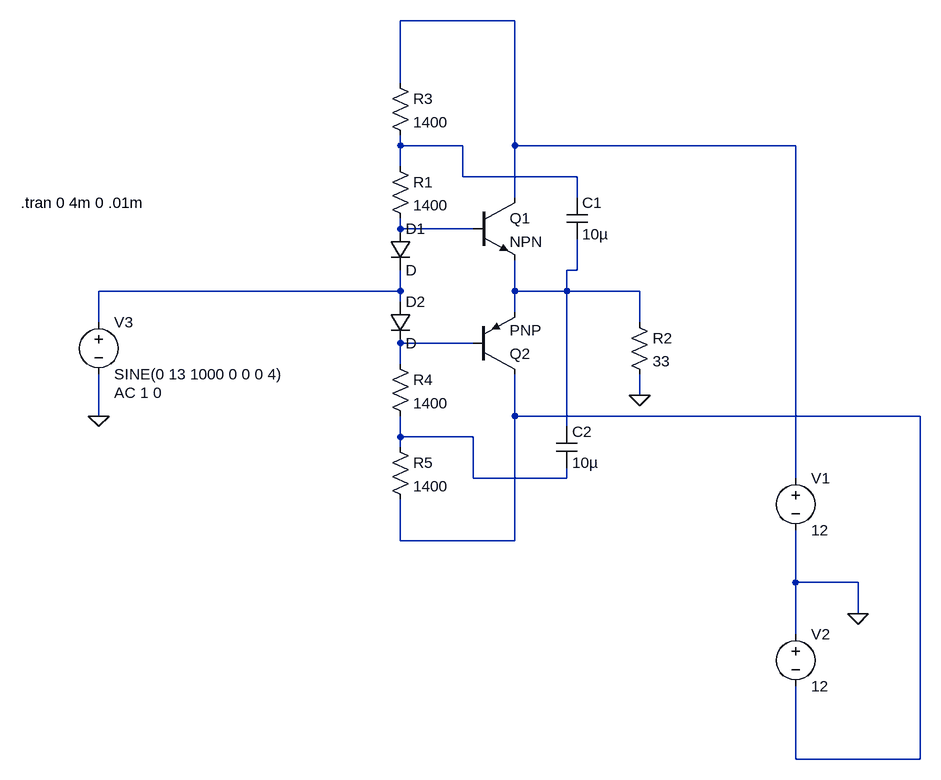
[diagram p0: schematic claseab3.asc]
claseab3.asc, the LTspice schematic file:
Version 4
SHEET 1 884 680
WIRE 256 -704 80 -704
WIRE 80 -608 80 -704
WIRE 80 -512 80 -528
WIRE 176 -512 80 -512
WIRE 256 -512 256 -704
WIRE 688 -512 256 -512
WIRE 80 -480 80 -512
WIRE 176 -464 176 -512
WIRE 352 -464 176 -464
WIRE 256 -432 256 -512
WIRE 352 -432 352 -464
WIRE 80 -384 80 -400
WIRE 192 -384 80 -384
WIRE 352 -320 352 -368
WIRE 352 -320 336 -320
WIRE 80 -288 80 -320
WIRE 80 -288 -384 -288
WIRE 256 -288 256 -336
WIRE 336 -288 336 -320
WIRE 336 -288 256 -288
WIRE 448 -288 336 -288
WIRE 80 -272 80 -288
WIRE 256 -256 256 -288
WIRE -384 -240 -384 -288
WIRE 448 -240 448 -288
WIRE 192 -208 80 -208
WIRE 80 -176 80 -208
WIRE 448 -128 448 -160
WIRE -384 -96 -384 -160
WIRE 256 -96 256 -160
WIRE 880 -96 256 -96
WIRE 336 -80 336 -288
WIRE 80 -64 80 -96
WIRE 192 -64 80 -64
WIRE 80 -48 80 -64
WIRE 192 0 192 -64
WIRE 336 0 336 -16
WIRE 336 0 192 0
WIRE 688 0 688 -512
WIRE 80 96 80 32
WIRE 256 96 256 -96
WIRE 256 96 80 96
WIRE 688 160 688 80
WIRE 784 160 688 160
WIRE 784 208 784 160
WIRE 688 240 688 160
WIRE 688 432 688 320
WIRE 880 432 880 -96
WIRE 880 432 688 432
FLAG 784 208 0
FLAG -384 -96 0
FLAG 448 -128 0
DATAFLAG 416 -288 ""
DATAFLAG 48 -288 ""
DATAFLAG 80 -384 ""
DATAFLAG 80 -208 ""
DATAFLAG 80 -64 ""
DATAFLAG 80 -512 ""
DATAFLAG 272 -416 "Ic(Q2)"
DATAFLAG 256 -288 ""
DATAFLAG 256 -112 ""
SYMBOL voltage 688 -16 R0
WINDOW 123 0 0 Left 2
WINDOW 39 0 0 Left 2
SYMATTR InstName V1
SYMATTR Value 12
SYMBOL voltage 688 224 R0
WINDOW 123 0 0 Left 2
WINDOW 39 0 0 Left 2
SYMATTR InstName V2
SYMATTR Value 12
SYMBOL voltage -384 -256 R0
WINDOW 123 24 124 Left 2
WINDOW 39 0 0 Left 2
SYMATTR Value2 AC 1 0
SYMATTR InstName V3
SYMATTR Value SINE(0 13 1000 0 0 0 4)
SYMBOL diode 64 -384 R0
SYMATTR InstName D1
SYMBOL diode 64 -272 R0
SYMATTR InstName D2
SYMBOL res 432 -256 R0
SYMATTR InstName R2
SYMATTR Value 33
SYMBOL npn 192 -432 R0
SYMATTR InstName Q1
SYMBOL pnp 192 -160 M180
SYMATTR InstName Q2
SYMBOL res 64 -496 R0
SYMATTR InstName R1
SYMATTR Value 1400
SYMBOL res 64 -624 R0
SYMATTR InstName R3
SYMATTR Value 1400
SYMBOL res 64 -192 R0
SYMATTR InstName R4
SYMATTR Value 1400
SYMBOL res 64 -64 R0
SYMATTR InstName R5
SYMATTR Value 1400
SYMBOL cap 336 -432 R0
SYMATTR InstName C1
SYMATTR Value 10µ
SYMBOL cap 320 -80 R0
SYMATTR InstName C2
SYMATTR Value 10µ
TEXT -504 -424 Left 2 !.tran 0 4m 0 .01m

The netlist it stands for:
* claseab3.asc
V1 N001 0 12
V2 0 N007 12
V3 N005 0 SINE(0 13 1000 0 0 0 4) AC 1 0
D1 N003 N005 D
D2 N005 N006 D
R2 N004 0 33
Q1 N001 N003 N004 0 NPN
Q2 N007 N006 N004 0 PNP
R1 N002 N003 1400
R3 N001 N002 1400
R4 N006 N008 1400
R5 N008 N007 1400
C1 N002 N004 10µ
C2 N004 N008 10µ
.model D D
.lib standard.dio
.model NPN NPN
.model PNP PNP
.lib standard.bjt
.tran 0 4m 0 .01m
.backanno
.end